# EAGLE schematic MojoShield_revA (EAGLE 6.5.0)
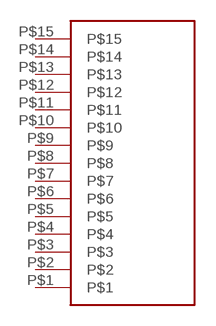
[diagram p0: schematic, sheet 1]

## Parts
U$1  VGA-DB15  [VGA-DB15]
Unconnected: U$1.P$1 U$1.P$2 U$1.P$3 U$1.P$4 U$1.P$5 U$1.P$6 U$1.P$7 U$1.P$8 U$1.P$9 U$1.P$10 U$1.P$11 U$1.P$12 U$1.P$13 U$1.P$14 U$1.P$15

## Library data of the parts
U$1 = vga-db15:VGA-DB15